# EAGLE design untitled (EAGLE 7.6.0)
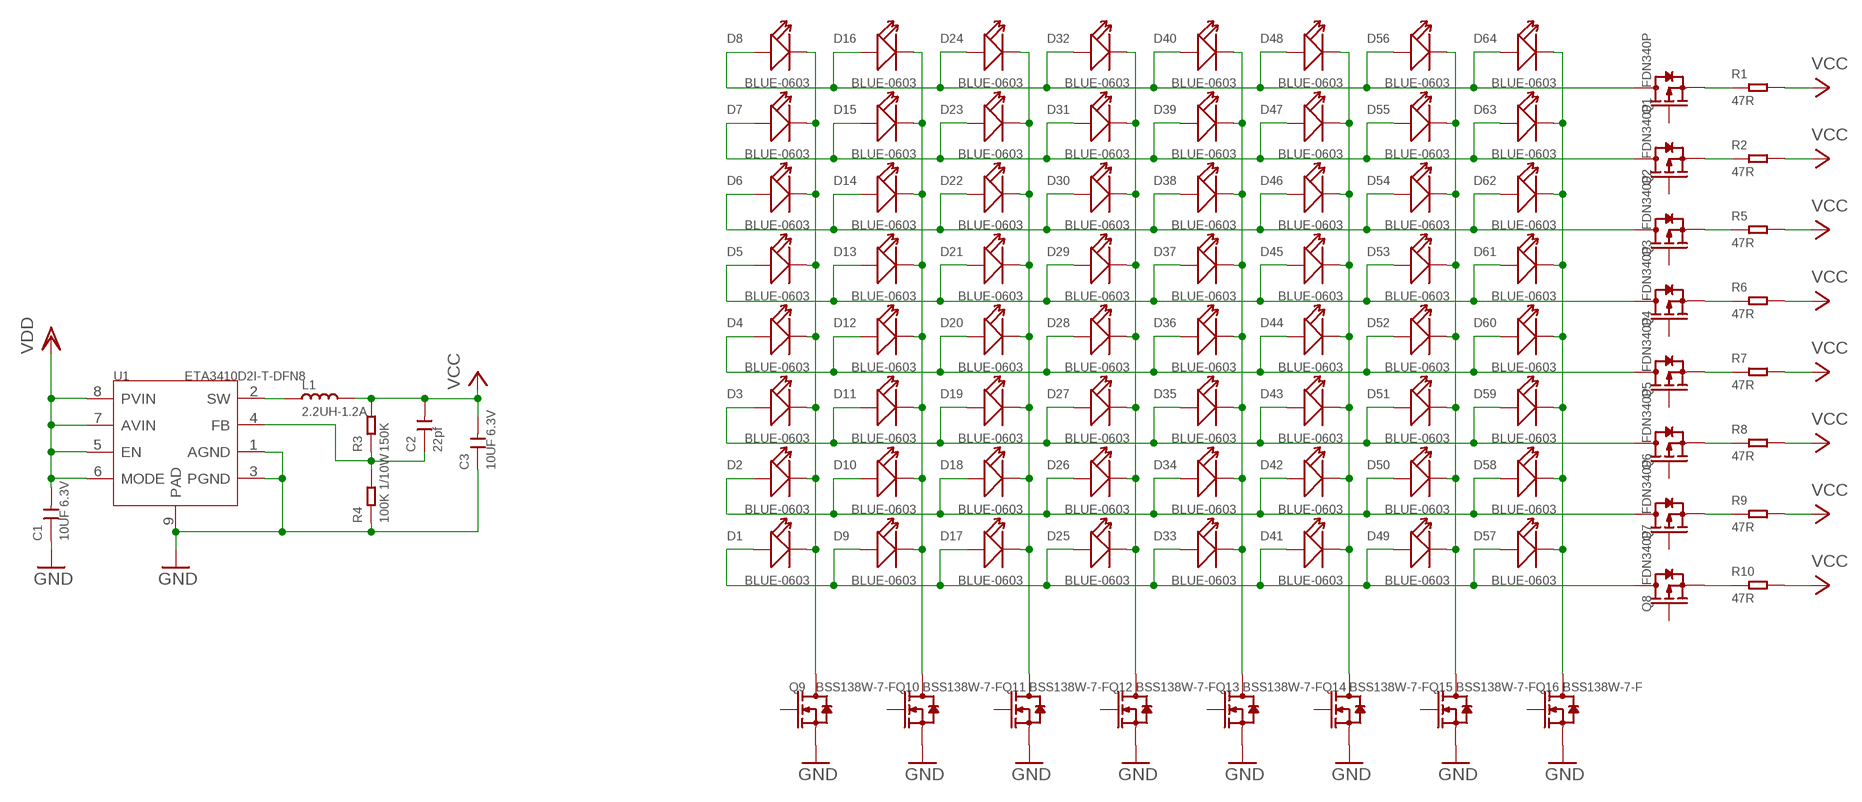
[diagram p0: schematic, sheet 1]

## Parts
C1  10UF 6.3V  CERAMIC-10UF-6.3V-20%-X5R(0603)  [C0603]
C2  22pf  CERAMIC-22PF-50V-5%-NPO(0603)  [C0603]
C3  10UF 6.3V  CERAMIC-10UF-6.3V-20%-X5R(0603)  [C0603]
D1  BLUE-0603  SMD-LED-CLEAR-BLUE(0603)  [LED-0603]
D2  BLUE-0603  SMD-LED-CLEAR-BLUE(0603)  [LED-0603]
D3  BLUE-0603  SMD-LED-CLEAR-BLUE(0603)  [LED-0603]
D4  BLUE-0603  SMD-LED-CLEAR-BLUE(0603)  [LED-0603]
D5  BLUE-0603  SMD-LED-CLEAR-BLUE(0603)  [LED-0603]
D6  BLUE-0603  SMD-LED-CLEAR-BLUE(0603)  [LED-0603]
D7  BLUE-0603  SMD-LED-CLEAR-BLUE(0603)  [LED-0603]
D8  BLUE-0603  SMD-LED-CLEAR-BLUE(0603)  [LED-0603]
D9  BLUE-0603  SMD-LED-CLEAR-BLUE(0603)  [LED-0603]
D10  BLUE-0603  SMD-LED-CLEAR-BLUE(0603)  [LED-0603]
D11  BLUE-0603  SMD-LED-CLEAR-BLUE(0603)  [LED-0603]
D12  BLUE-0603  SMD-LED-CLEAR-BLUE(0603)  [LED-0603]
D13  BLUE-0603  SMD-LED-CLEAR-BLUE(0603)  [LED-0603]
D14  BLUE-0603  SMD-LED-CLEAR-BLUE(0603)  [LED-0603]
D15  BLUE-0603  SMD-LED-CLEAR-BLUE(0603)  [LED-0603]
D16  BLUE-0603  SMD-LED-CLEAR-BLUE(0603)  [LED-0603]
D17  BLUE-0603  SMD-LED-CLEAR-BLUE(0603)  [LED-0603]
D18  BLUE-0603  SMD-LED-CLEAR-BLUE(0603)  [LED-0603]
D19  BLUE-0603  SMD-LED-CLEAR-BLUE(0603)  [LED-0603]
D20  BLUE-0603  SMD-LED-CLEAR-BLUE(0603)  [LED-0603]
D21  BLUE-0603  SMD-LED-CLEAR-BLUE(0603)  [LED-0603]
D22  BLUE-0603  SMD-LED-CLEAR-BLUE(0603)  [LED-0603]
D23  BLUE-0603  SMD-LED-CLEAR-BLUE(0603)  [LED-0603]
D24  BLUE-0603  SMD-LED-CLEAR-BLUE(0603)  [LED-0603]
D25  BLUE-0603  SMD-LED-CLEAR-BLUE(0603)  [LED-0603]
D26  BLUE-0603  SMD-LED-CLEAR-BLUE(0603)  [LED-0603]
D27  BLUE-0603  SMD-LED-CLEAR-BLUE(0603)  [LED-0603]
D28  BLUE-0603  SMD-LED-CLEAR-BLUE(0603)  [LED-0603]
D29  BLUE-0603  SMD-LED-CLEAR-BLUE(0603)  [LED-0603]
D30  BLUE-0603  SMD-LED-CLEAR-BLUE(0603)  [LED-0603]
D31  BLUE-0603  SMD-LED-CLEAR-BLUE(0603)  [LED-0603]
D32  BLUE-0603  SMD-LED-CLEAR-BLUE(0603)  [LED-0603]
D33  BLUE-0603  SMD-LED-CLEAR-BLUE(0603)  [LED-0603]
D34  BLUE-0603  SMD-LED-CLEAR-BLUE(0603)  [LED-0603]
D35  BLUE-0603  SMD-LED-CLEAR-BLUE(0603)  [LED-0603]
D36  BLUE-0603  SMD-LED-CLEAR-BLUE(0603)  [LED-0603]
D37  BLUE-0603  SMD-LED-CLEAR-BLUE(0603)  [LED-0603]
D38  BLUE-0603  SMD-LED-CLEAR-BLUE(0603)  [LED-0603]
D39  BLUE-0603  SMD-LED-CLEAR-BLUE(0603)  [LED-0603]
D40  BLUE-0603  SMD-LED-CLEAR-BLUE(0603)  [LED-0603]
D41  BLUE-0603  SMD-LED-CLEAR-BLUE(0603)  [LED-0603]
D42  BLUE-0603  SMD-LED-CLEAR-BLUE(0603)  [LED-0603]
D43  BLUE-0603  SMD-LED-CLEAR-BLUE(0603)  [LED-0603]
D44  BLUE-0603  SMD-LED-CLEAR-BLUE(0603)  [LED-0603]
D45  BLUE-0603  SMD-LED-CLEAR-BLUE(0603)  [LED-0603]
D46  BLUE-0603  SMD-LED-CLEAR-BLUE(0603)  [LED-0603]
D47  BLUE-0603  SMD-LED-CLEAR-BLUE(0603)  [LED-0603]
D48  BLUE-0603  SMD-LED-CLEAR-BLUE(0603)  [LED-0603]
D49  BLUE-0603  SMD-LED-CLEAR-BLUE(0603)  [LED-0603]
D50  BLUE-0603  SMD-LED-CLEAR-BLUE(0603)  [LED-0603]
D51  BLUE-0603  SMD-LED-CLEAR-BLUE(0603)  [LED-0603]
D52  BLUE-0603  SMD-LED-CLEAR-BLUE(0603)  [LED-0603]
D53  BLUE-0603  SMD-LED-CLEAR-BLUE(0603)  [LED-0603]
D54  BLUE-0603  SMD-LED-CLEAR-BLUE(0603)  [LED-0603]
D55  BLUE-0603  SMD-LED-CLEAR-BLUE(0603)  [LED-0603]
D56  BLUE-0603  SMD-LED-CLEAR-BLUE(0603)  [LED-0603]
D57  BLUE-0603  SMD-LED-CLEAR-BLUE(0603)  [LED-0603]
D58  BLUE-0603  SMD-LED-CLEAR-BLUE(0603)  [LED-0603]
D59  BLUE-0603  SMD-LED-CLEAR-BLUE(0603)  [LED-0603]
D60  BLUE-0603  SMD-LED-CLEAR-BLUE(0603)  [LED-0603]
D61  BLUE-0603  SMD-LED-CLEAR-BLUE(0603)  [LED-0603]
D62  BLUE-0603  SMD-LED-CLEAR-BLUE(0603)  [LED-0603]
D63  BLUE-0603  SMD-LED-CLEAR-BLUE(0603)  [LED-0603]
D64  BLUE-0603  SMD-LED-CLEAR-BLUE(0603)  [LED-0603]
L1  2.2UH-1.2A  SMD-INDUCTOR-2.2UH-20%-1.2A(0805)  [L0805]
Q1  FDN340P  SMD-MOSFET-P-CH-20V-2A-FDN340P(SOT-23)  [SOT-23]
Q2  FDN340P  SMD-MOSFET-P-CH-20V-2A-FDN340P(SOT-23)  [SOT-23]
Q3  FDN340P  SMD-MOSFET-P-CH-20V-2A-FDN340P(SOT-23)  [SOT-23]
Q4  FDN340P  SMD-MOSFET-P-CH-20V-2A-FDN340P(SOT-23)  [SOT-23]
Q5  FDN340P  SMD-MOSFET-P-CH-20V-2A-FDN340P(SOT-23)  [SOT-23]
Q6  FDN340P  SMD-MOSFET-P-CH-20V-2A-FDN340P(SOT-23)  [SOT-23]
Q7  FDN340P  SMD-MOSFET-P-CH-20V-2A-FDN340P(SOT-23)  [SOT-23]
Q8  FDN340P  SMD-MOSFET-P-CH-20V-2A-FDN340P(SOT-23)  [SOT-23]
Q9  BSS138W-7-F  SMD-MOSFET-N-CH-50V-200MA-BSS138W-7-F(SOT-23)  [SOT-23]
Q10  BSS138W-7-F  SMD-MOSFET-N-CH-50V-200MA-BSS138W-7-F(SOT-23)  [SOT-23]
Q11  BSS138W-7-F  SMD-MOSFET-N-CH-50V-200MA-BSS138W-7-F(SOT-23)  [SOT-23]
Q12  BSS138W-7-F  SMD-MOSFET-N-CH-50V-200MA-BSS138W-7-F(SOT-23)  [SOT-23]
Q13  BSS138W-7-F  SMD-MOSFET-N-CH-50V-200MA-BSS138W-7-F(SOT-23)  [SOT-23]
Q14  BSS138W-7-F  SMD-MOSFET-N-CH-50V-200MA-BSS138W-7-F(SOT-23)  [SOT-23]
Q15  BSS138W-7-F  SMD-MOSFET-N-CH-50V-200MA-BSS138W-7-F(SOT-23)  [SOT-23]
Q16  BSS138W-7-F  SMD-MOSFET-N-CH-50V-200MA-BSS138W-7-F(SOT-23)  [SOT-23]
R1  47R  DIP-RES-47R-5%-1/4W(PR-D2.3XL6.5MM)  [PR-D2.3XL6.5MM]
R2  47R  DIP-RES-47R-5%-1/4W(PR-D2.3XL6.5MM)  [PR-D2.3XL6.5MM]
R3  150K  SMD-RES-150K-1%-1/10W(0603)  [R0603]
R4  100K 1/10W  SMD-RES-100K-5%-1/10W(0603)  [R0603]
R5  47R  DIP-RES-47R-5%-1/4W(PR-D2.3XL6.5MM)  [PR-D2.3XL6.5MM]
R6  47R  DIP-RES-47R-5%-1/4W(PR-D2.3XL6.5MM)  [PR-D2.3XL6.5MM]
R7  47R  DIP-RES-47R-5%-1/4W(PR-D2.3XL6.5MM)  [PR-D2.3XL6.5MM]
R8  47R  DIP-RES-47R-5%-1/4W(PR-D2.3XL6.5MM)  [PR-D2.3XL6.5MM]
R9  47R  DIP-RES-47R-5%-1/4W(PR-D2.3XL6.5MM)  [PR-D2.3XL6.5MM]
R10  47R  DIP-RES-47R-5%-1/4W(PR-D2.3XL6.5MM)  [PR-D2.3XL6.5MM]
U1  ETA3410D2I-T-DFN8  PMIC-ETA3410D2I-T(DFN8-2X2)  [DFN8G-0.5-2X2MM]

## Nets
GND: C1.1 C3.1 Q9.2(S) Q10.2(S) Q11.2(S) Q12.2(S) Q13.2(S) Q14.2(S) Q15.2(S) Q16.2(S) R4.1 U1.1(AGND) U1.3(PGND) U1.9(PAD)
N$1: D17.- D18.- D19.- D20.- D21.- D22.- D23.- D24.- Q11.3(D)
N$2: D2.+ D10.+ D18.+ D26.+ D34.+ D42.+ D50.+ D58.+ Q7.3(D)
N$3: D3.+ D11.+ D19.+ D27.+ D35.+ D43.+ D51.+ D59.+ Q6.3(D)
N$4: D4.+ D12.+ D20.+ D28.+ D36.+ D44.+ D52.+ D60.+ Q5.3(D)
N$5: D5.+ D13.+ D21.+ D29.+ D37.+ D45.+ D53.+ D61.+ Q4.3(D)
N$6: D6.+ D14.+ D22.+ D30.+ D38.+ D46.+ D54.+ D62.+ Q3.3(D)
N$7: D7.+ D15.+ D23.+ D31.+ D39.+ D47.+ D55.+ D63.+ Q2.3(D)
N$8: D8.+ D16.+ D24.+ D32.+ D40.+ D48.+ D56.+ D64.+ Q1.3(D)
N$9: D1.+ D9.+ D17.+ D25.+ D33.+ D41.+ D49.+ D57.+ Q8.3(D)
N$10: D1.- D2.- D3.- D4.- D5.- D6.- D7.- D8.- Q9.3(D)
N$11: D9.- D10.- D11.- D12.- D13.- D14.- D15.- D16.- Q10.3(D)
N$12: D25.- D26.- D27.- D28.- D29.- D30.- D31.- D32.- Q12.3(D)
N$13: D33.- D34.- D35.- D36.- D37.- D38.- D39.- D40.- Q13.3(D)
N$14: D41.- D42.- D43.- D44.- D45.- D46.- D47.- D48.- Q14.3(D)
N$15: D49.- D50.- D51.- D52.- D53.- D54.- D55.- D56.- Q15.3(D)
N$16: D57.- D58.- D59.- D60.- D61.- D62.- D63.- D64.- Q16.3(D)
N$17: L1.1 U1.2(SW)
N$18: Q1.2(S) R1.1
N$19: C2.1 R3.1 R4.2 U1.4(FB)
N$20: Q2.2(S) R2.1
N$21: Q3.2(S) R5.1
N$22: Q4.2(S) R6.1
N$23: Q5.2(S) R7.1
N$24: Q6.2(S) R8.1
N$25: Q7.2(S) R9.1
N$26: Q8.2(S) R10.1
VCC: C2.2 C3.2 L1.2 R1.2 R2.2 R3.2 R5.2 R6.2 R7.2 R8.2 R9.2 R10.2
VDD: C1.2 U1.5(EN) U1.6(MODE) U1.7(AVIN) U1.8(PVIN)
Unconnected: Q1.1(G) Q2.1(G) Q3.1(G) Q4.1(G) Q5.1(G) Q6.1(G) Q7.1(G) Q8.1(G) Q9.1(G) Q10.1(G) Q11.1(G) Q12.1(G) Q13.1(G) Q14.1(G) Q15.1(G) Q16.1(G)

## Library data of the parts
C1 C3 = Seeed-Capacitor-2016:CERAMIC-10UF-6.3V-20%-X5R(0603): 302010286; MPN: CC0603MRX5R5BB106
C2 = Seeed-Capacitor-2016:CERAMIC-22PF-50V-5%-NPO(0603): 302010143; MPN: CC0603JRNPO9BN220
D1-D64 = Seeed-LED-2016:SMD-LED-CLEAR-BLUE(0603): 304090045; MPN: 19-217-BHC-ZL1M2RY-3T
L1 = Seeed-Inductor-2016:SMD-INDUCTOR-2.2UH-20%-1.2A(0805): 303010086; MPN: LQM2MPN2R2MG0
Q1-Q8 = Seeed-Transistor-2016:SMD-MOSFET-P-CH-20V-2A-FDN340P(SOT-23): 305030026; MPN: FDN340P
Q9-Q16 = Seeed-Transistor-2016:SMD-MOSFET-N-CH-50V-200MA-BSS138W-7-F(SOT-23): 305030000; MPN: BSS138W-7-F
R1 R2 R5-R10 = Seeed-Resistor-2016:DIP-RES-47R-5%-1/4W(PR-D2.3XL6.5MM): 301020014; MPN: FHCFR-1/4W-470J
R3 = Seeed-Resistor-2016:SMD-RES-150K-1%-1/10W(0603): 301010205; MPN: RC0603FR-07150KL
R4 = Seeed-Resistor-2016:SMD-RES-100K-5%-1/10W(0603): 301010089; MPN: RC0603JR-07100KL
U1 = Seeed-IC-2016:PMIC-ETA3410D2I-T(DFN8-2X2): 310030161; MPN: ETA3410D2I-T

## Board
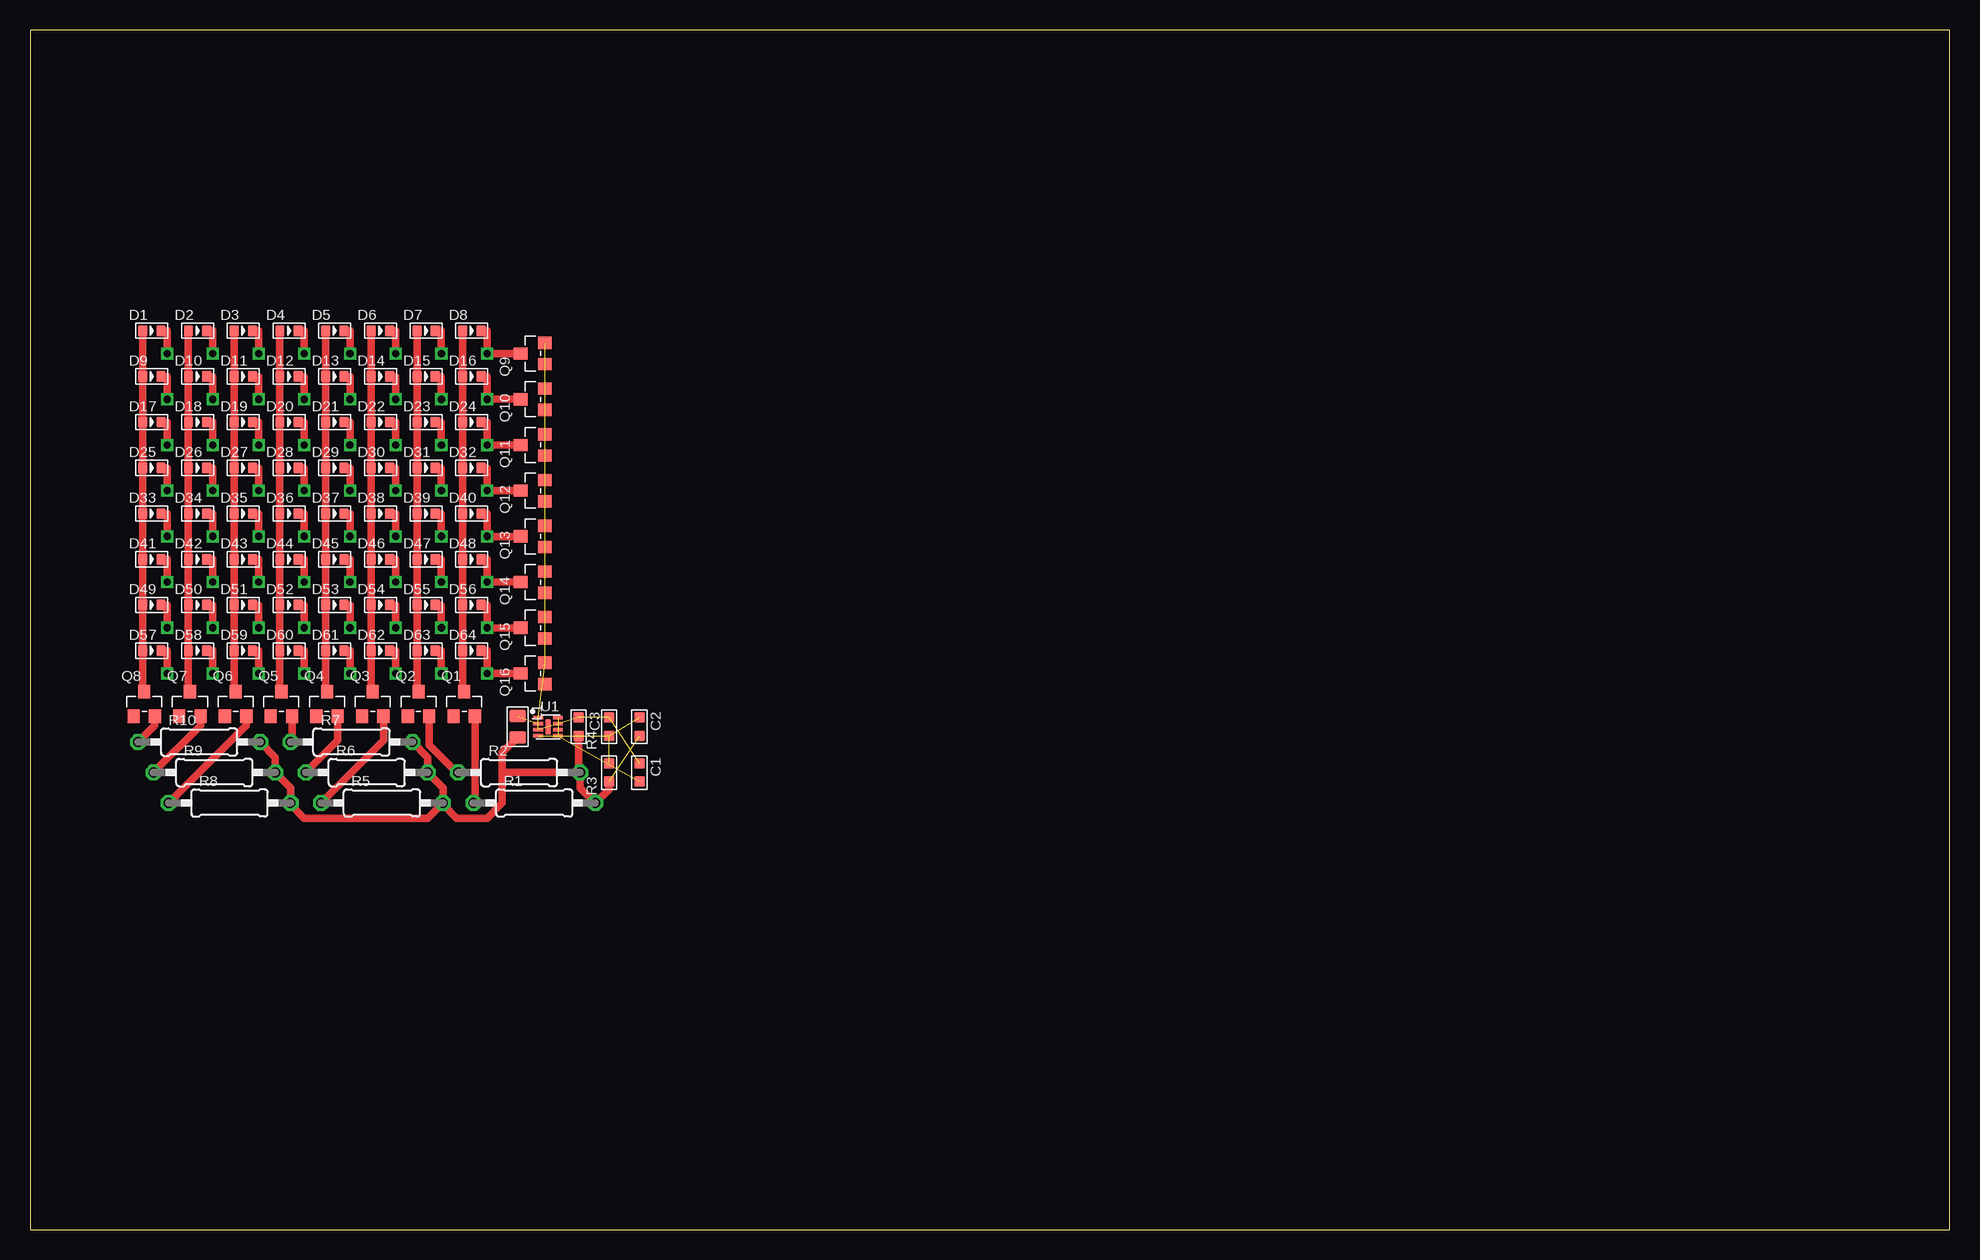
[diagram p1: board, top side]
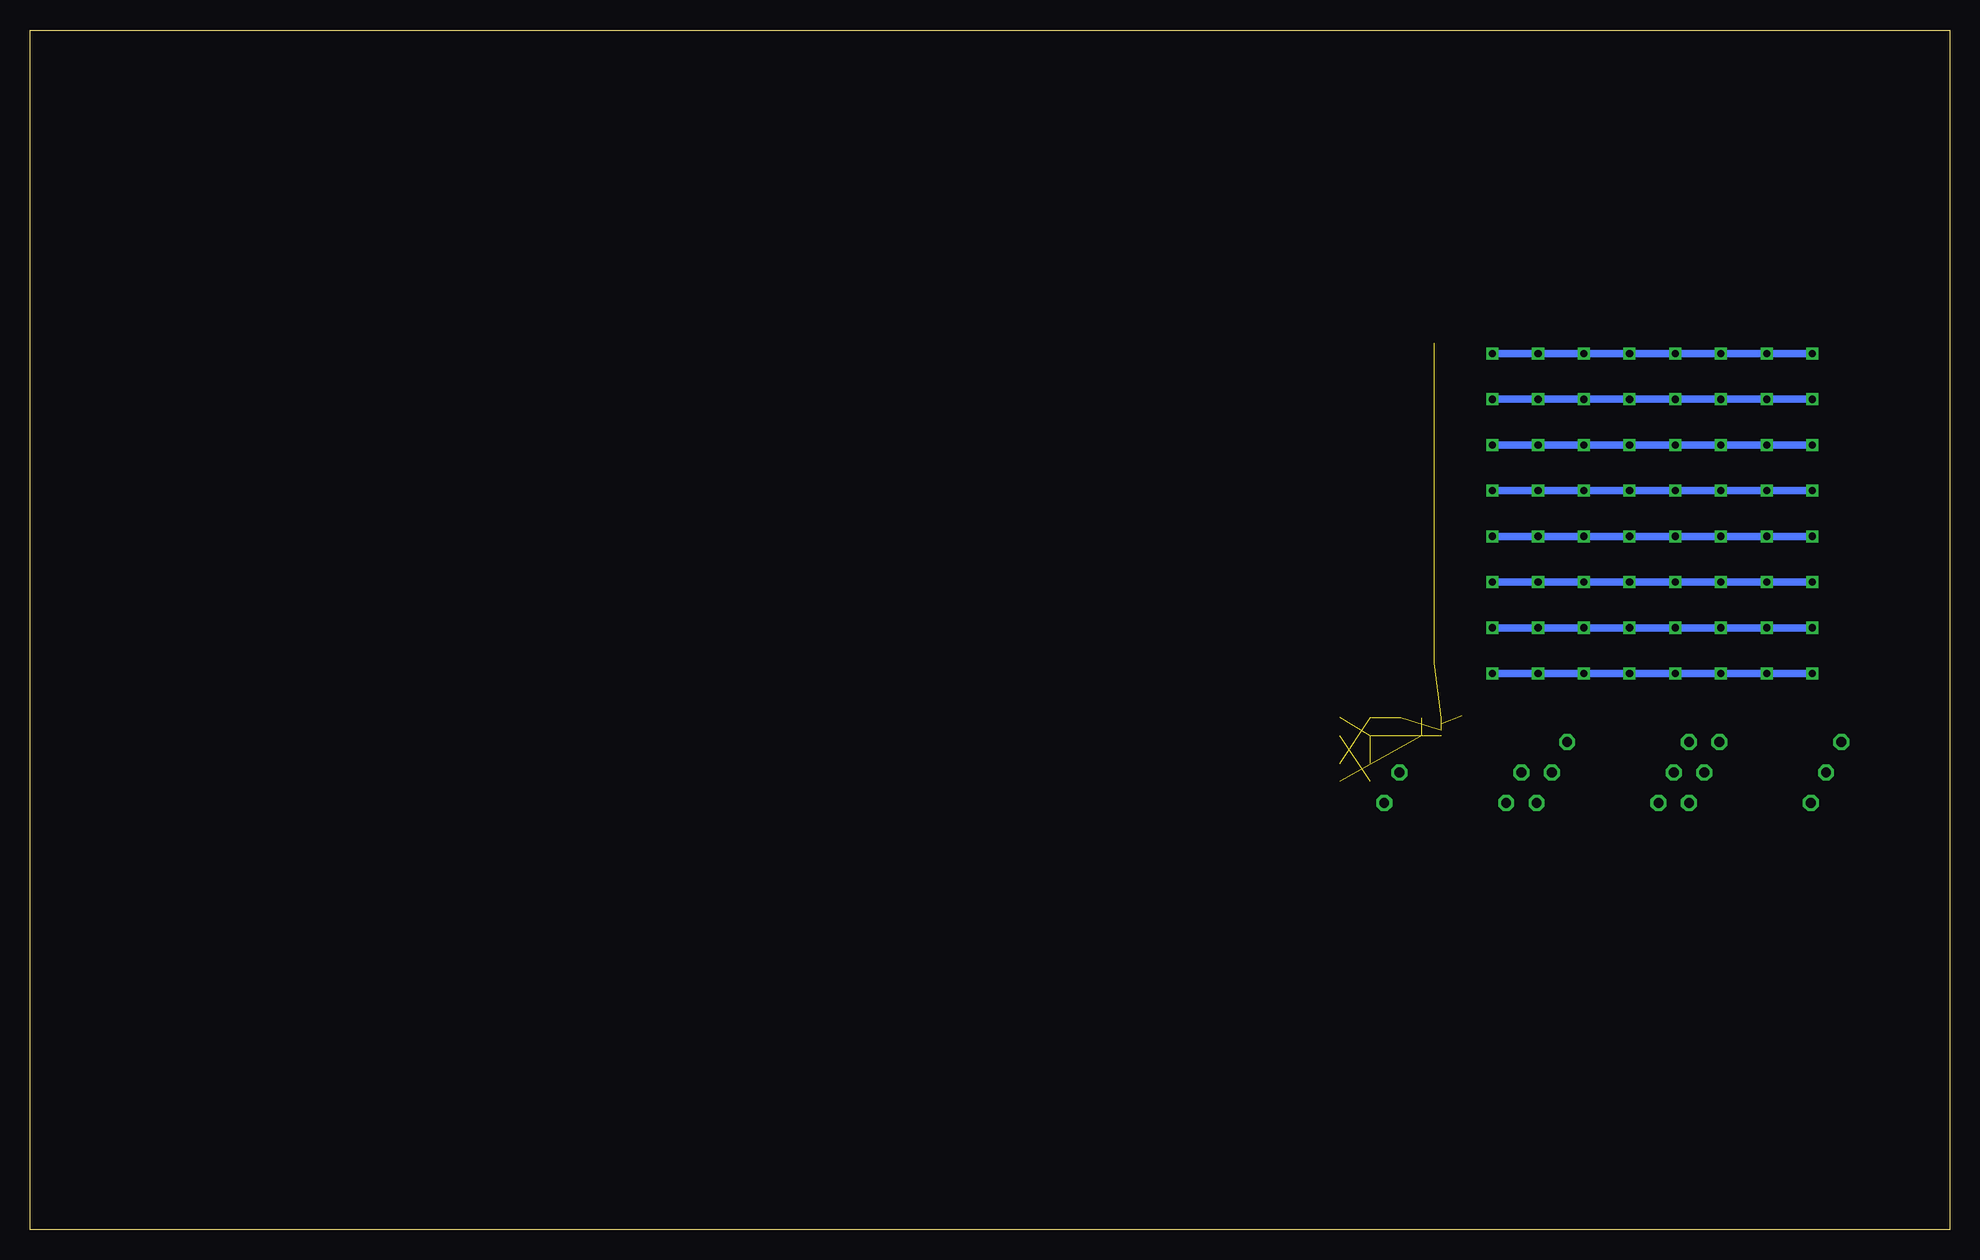
[diagram p2: board, bottom side, seen from below]

Size 160 x 100 mm. Coordinates in mm from the lower left corner, seen from the top.
Outline: 0,0 160,0 160,100 0,100 0,0
Copper layers (1*16): Top 0.035mm / dielectric 1.5mm / Bottom 0.035mm
Design rules "default": minimum track width 10mil, minimum drill 24mil, track to track 8mil, track to pad 8mil, pad to pad 8mil, via to via 8mil, smd to smd 8mil, copper to edge 40mil, drill to drill 8mil, minimum pad ring 10mil, minimum via ring 8mil, stop-mask expansion 4mil, vias tented up to drill 0mil, thermal gap 10mil

### Footprints (pad centres in the part's own frame; a part is rotated, then mirrored left to right if it is on the bottom)
C0603 = smd 0.889 x 0.889: 1 0,0.762; 2 0,-0.762
LED-0603 = smd 0.762 x 0.889: + -0.762,0; - 0.762,0
L0805 = smd 1.016 x 1.397: 1 -0.889,0; 2 0.889,0
SOT-23 = smd 1.016 x 1.143: 1 -0.889,-1.016; 2 0.889,-1.016; 3 0,1.016
PR-D2.3XL6.5MM = drill 0.813 octagon: 1 -4.953,0; 2 5.207,0
R0603 = smd 0.889 x 0.889: 1 0,0.762; 2 0,-0.762
DFN8G-0.5-2X2MM = smd 0.8 x 0.3: 1 -0.827,0.75; 2 -0.827,0.25; 3 -0.827,-0.25; 4 -0.827,-0.75; 5 0.827,-0.75; 6 0.827,-0.25; 7 0.827,0.25; 8 0.827,0.75 | smd 0.45 x 1.3: 9 0,0

### Placement (x,y rotation side)
C1  50.8,38.1 0 top
C2  50.8,41.91 0 top
C3  45.72,41.91 0 top
D1  10.16,74.93 0 top
D2  13.97,74.93 0 top
D3  17.78,74.93 0 top
D4  21.59,74.93 0 top
D5  25.4,74.93 0 top
D6  29.21,74.93 0 top
D7  33.02,74.93 0 top
D8  36.83,74.93 0 top
D9  10.16,71.12 0 top
D10  13.97,71.12 0 top
D11  17.78,71.12 0 top
D12  21.59,71.12 0 top
D13  25.4,71.12 0 top
D14  29.21,71.12 0 top
D15  33.02,71.12 0 top
D16  36.83,71.12 0 top
D17  10.16,67.31 0 top
D18  13.97,67.31 0 top
D19  17.78,67.31 0 top
D20  21.59,67.31 0 top
D21  25.4,67.31 0 top
D22  29.21,67.31 0 top
D23  33.02,67.31 0 top
D24  36.83,67.31 0 top
D25  10.16,63.5 0 top
D26  13.97,63.5 0 top
D27  17.78,63.5 0 top
D28  21.59,63.5 0 top
D29  25.4,63.5 0 top
D30  29.21,63.5 0 top
D31  33.02,63.5 0 top
D32  36.83,63.5 0 top
D33  10.16,59.69 0 top
D34  13.97,59.69 0 top
D35  17.78,59.69 0 top
D36  21.59,59.69 0 top
D37  25.4,59.69 0 top
D38  29.21,59.69 0 top
D39  33.02,59.69 0 top
D40  36.83,59.69 0 top
D41  10.16,55.88 0 top
D42  13.97,55.88 0 top
D43  17.78,55.88 0 top
D44  21.59,55.88 0 top
D45  25.4,55.88 0 top
D46  29.21,55.88 0 top
D47  33.02,55.88 0 top
D48  36.83,55.88 0 top
D49  10.16,52.07 0 top
D50  13.97,52.07 0 top
D51  17.78,52.07 0 top
D52  21.59,52.07 0 top
D53  25.4,52.07 0 top
D54  29.21,52.07 0 top
D55  33.02,52.07 0 top
D56  36.83,52.07 0 top
D57  10.16,48.26 0 top
D58  13.97,48.26 0 top
D59  17.78,48.26 0 top
D60  21.59,48.26 0 top
D61  25.4,48.26 0 top
D62  29.21,48.26 0 top
D63  33.02,48.26 0 top
D64  36.83,48.26 0 top
L1  40.64,41.91 270 top
Q1  36.2,43.81 0 top
Q2  32.38,43.81 0 top
Q3  28.57,43.81 0 top
Q4  24.77,43.81 0 top
Q5  20.95,43.81 0 top
Q6  17.14,43.81 0 top
Q7  13.34,43.81 0 top
Q8  9.53,43.81 0 top
Q9  41.91,73.03 90 top
Q10  41.91,69.22 90 top
Q11  41.91,65.41 90 top
Q12  41.91,61.59 90 top
Q13  41.91,57.78 90 top
Q14  41.91,53.98 90 top
Q15  41.91,50.16 90 top
Q16  41.91,46.35 90 top
R1  41.91,35.56 0 top
R2  40.64,38.1 0 top
R3  48.26,38.1 0 top
R4  48.26,41.91 0 top
R5  29.21,35.56 0 top
R6  27.94,38.1 0 top
R7  26.67,40.64 0 top
R8  16.51,35.56 0 top
R9  15.24,38.1 0 top
R10  13.97,40.64 0 top
U1  43.18,41.91 0 top

### Tracks (layer width: path | path; a pad name or v marks a point on that pad's centre or on a via)
GND  (13 unrouted)
N$1  (via drill 0.6)
  Top 0.61: D17.- 11.43,67.31 v11.43,65.41 | D18.- 15.24,67.31 v15.24,65.41 | D19.- 19.05,67.31 v19.05,65.41 | D20.- 22.86,67.31 v22.86,65.41 | D21.- 26.67,67.31 v26.67,65.41 | D22.- 30.48,67.31 v30.48,65.41 | D23.- 34.29,67.31 v34.29,65.41 | D24.- 38.1,67.31 v38.1,65.41 Q11.3
  Bottom 0.61: v11.43,65.41 v15.24,65.41 v19.05,65.41 v22.86,65.41 v26.67,65.41 v30.48,65.41 v34.29,65.41 v38.1,65.41
N$2
  Top 0.61: D2.+ D10.+ D18.+ D26.+ D34.+ D42.+ D50.+ D58.+ 13.21,44.83 Q7.3
N$3
  Top 0.61: D3.+ D11.+ D19.+ D27.+ D35.+ D43.+ D51.+ D59.+ 17.02,44.83 Q6.3
N$4
  Top 0.61: D4.+ D12.+ D20.+ D28.+ D36.+ D44.+ D52.+ D60.+ 20.83,44.83 Q5.3
N$5
  Top 0.61: D5.+ D13.+ D21.+ D29.+ D37.+ D45.+ D53.+ D61.+ 24.64,44.83 Q4.3
N$6
  Top 0.61: D6.+ D14.+ D22.+ D30.+ D38.+ D46.+ D54.+ D62.+ 28.45,44.83 Q3.3
N$7
  Top 0.61: D7.+ D15.+ D23.+ D31.+ D39.+ D47.+ D55.+ D63.+ 32.26,44.83 Q2.3
N$8
  Top 0.61: D8.+ D16.+ D24.+ D32.+ D40.+ D48.+ D56.+ D64.+ 36.07,44.83 Q1.3
N$9
  Top 0.61: D1.+ D9.+ D17.+ D25.+ D33.+ D41.+ D49.+ D57.+ 9.4,44.83 Q8.3
N$10  (via drill 0.6)
  Top 0.61: D1.- 11.43,74.93 v11.43,73.03 | D2.- 15.24,74.93 v15.24,73.03 | D3.- 19.05,74.93 v19.05,73.03 | D4.- 22.86,74.93 v22.86,73.03 | D5.- 26.67,74.93 v26.67,73.03 | D6.- 30.48,74.93 v30.48,73.03 | D7.- 34.29,74.93 v34.29,73.03 | D8.- 38.1,74.93 v38.1,73.03 Q9.3
  Bottom 0.61: v11.43,73.03 v15.24,73.03 v19.05,73.03 v22.86,73.03 v26.67,73.03 v30.48,73.03 v34.29,73.03 v38.1,73.03
N$11  (via drill 0.6)
  Top 0.61: D9.- 11.43,71.12 v11.43,69.22 | D10.- 15.24,71.12 v15.24,69.22 | D11.- 19.05,71.12 v19.05,69.22 | D12.- 22.86,71.12 v22.86,69.22 | D13.- 26.67,71.12 v26.67,69.22 | D14.- 30.48,71.12 v30.48,69.22 | D15.- 34.29,71.12 v34.29,69.22 | D16.- 38.1,71.12 v38.1,69.22 Q10.3
  Bottom 0.61: v11.43,69.22 v15.24,69.22 v19.05,69.22 v22.86,69.22 v26.67,69.22 v30.48,69.22 v34.29,69.22 v38.1,69.22
N$12  (via drill 0.6)
  Top 0.61: D25.- 11.43,63.5 v11.43,61.59 | D26.- 15.24,63.5 v15.24,61.59 | D27.- 19.05,63.5 v19.05,61.59 | D28.- 22.86,63.5 v22.86,61.59 | D29.- 26.67,63.5 v26.67,61.59 | D30.- 30.48,63.5 v30.48,61.59 | D31.- 34.29,63.5 v34.29,61.59 | D32.- 38.1,63.5 v38.1,61.59 Q12.3
  Bottom 0.61: v11.43,61.59 v15.24,61.59 v19.05,61.59 v22.86,61.59 v26.67,61.59 v30.48,61.59 v34.29,61.59 v38.1,61.59
N$13  (via drill 0.6)
  Top 0.61: D33.- 11.43,59.69 v11.43,57.78 | D34.- 15.24,59.69 v15.24,57.78 | D35.- 19.05,59.69 v19.05,57.78 | D36.- 22.86,59.69 v22.86,57.78 | D37.- 26.67,59.69 v26.67,57.78 | D38.- 30.48,59.69 v30.48,57.78 | D39.- 34.29,59.69 v34.29,57.78 | D40.- 38.1,59.69 v38.1,57.78 Q13.3
  Bottom 0.61: v11.43,57.78 v15.24,57.78 v19.05,57.78 v22.86,57.78 v26.67,57.78 v30.48,57.78 v34.29,57.78 v38.1,57.78
N$14  (via drill 0.6)
  Top 0.61: D41.- 11.43,55.88 v11.43,53.98 | D42.- 15.24,55.88 v15.24,53.98 | D43.- 19.05,55.88 v19.05,53.98 | D44.- 22.86,55.88 v22.86,53.98 | D45.- 26.67,55.88 v26.67,53.98 | D46.- 30.48,55.88 v30.48,53.98 | D47.- 34.29,55.88 v34.29,53.98 | D48.- 38.1,55.88 v38.1,53.98 Q14.3
  Bottom 0.61: v11.43,53.98 v15.24,53.98 v19.05,53.98 v22.86,53.98 v26.67,53.98 v30.48,53.98 v34.29,53.98 v38.1,53.98
N$15  (via drill 0.6)
  Top 0.61: D49.- 11.43,52.07 v11.43,50.16 | D50.- 15.24,52.07 v15.24,50.16 | D51.- 19.05,52.07 v19.05,50.16 | D52.- 22.86,52.07 v22.86,50.16 | D53.- 26.67,52.07 v26.67,50.16 | D54.- 30.48,52.07 v30.48,50.16 | D55.- 34.29,52.07 v34.29,50.16 | D56.- 38.1,52.07 v38.1,50.16 Q15.3
  Bottom 0.61: v11.43,50.16 v15.24,50.16 v19.05,50.16 v22.86,50.16 v26.67,50.16 v30.48,50.16 v34.29,50.16 v38.1,50.16
N$16  (via drill 0.6)
  Top 0.61: D57.- 11.43,48.26 v11.43,46.35 | D58.- 15.24,48.26 v15.24,46.35 | D59.- 19.05,48.26 v19.05,46.35 | D60.- 22.86,48.26 v22.86,46.35 | D61.- 26.67,48.26 v26.67,46.35 | D62.- 30.48,48.26 v30.48,46.35 | D63.- 34.29,48.26 v34.29,46.35 | D64.- 38.1,48.26 v38.1,46.35 Q16.3
  Bottom 0.61: v11.43,46.35 v15.24,46.35 v19.05,46.35 v22.86,46.35 v26.67,46.35 v30.48,46.35 v34.29,46.35 v38.1,46.35
N$17  (1 unrouted)
N$18
  Top 0.61: Q1.2 37.08,35.69 R1.1
N$19  (3 unrouted)
N$20
  Top 0.61: Q2.2 33.27,40.39 35.56,38.1 R2.1
N$21
  Top 0.61: Q3.2 29.46,40.77 R5.1
N$22
  Top 0.61: Q4.2 25.65,40.77 R6.1
N$23
  Top 0.61: Q5.2 21.84,40.77 R7.1
N$24
  Top 0.61: Q6.2 18.03,42.04 R8.1
N$25
  Top 0.61: Q7.2 14.22,42.04 R9.1
N$26
  Top 0.61: Q8.2 10.41,42.04 R10.1
VCC  (1 unrouted)
  Top 0.61: R2.2 45.85,36.83 R1.2 48.26,36.7 R3.2 | C3.2 45.72,38.23 R2.2 | R5.2 34.42,36.83 R6.2 33.15,39.37 R7.2 | R10.2 20.45,39.37 R9.2 21.72,36.83 R8.2 21.72,35.43 22.86,34.29 33.15,34.29 R5.2 | R5.2 34.42,35.43 35.56,34.29 38.1,34.29 39.37,35.56 39.37,38.1 | 39.37,38.1 39.37,39.75 L1.2 | R2.2 39.37,38.1
VDD  (4 unrouted)